# Altium schematic sheet Interfaz de Memoria.SchDoc
size Letter; ApprovedBy: M. en C. Fernando Bolaños; CheckedBy: M. en C. José Alberto Balderas Castillo (CID); Author: M. en C. José Alberto Balderas Castillo (CID); Revision: v1; NombreTarjeta: TELCOMGPRS-v1; NumeroDeHoja: 3 de 7; NombreBloque: Memorias externas EEPROM; FechaDiseno: 02-Junio-2015; FechaRevision: 05-Junio-2015; FechaAprobacion: 16-Junio-2015; TamanoHoja: Carta; NombreProyecto: Telemetria GPRS de Bajo Consumo de Energia
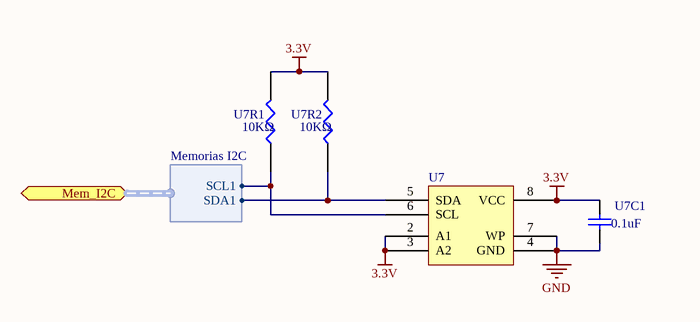
[diagram p0: Interfaz de Memoria.SchDoc]

## Parts
U7  CAT24M01WI-GT3  [SO-G8/Y1.9]  (value not drawn)
U7C1  0.1uF  [0603 - CAP]
U7R1  10KΩ  [0805-RES]
U7R2  10KΩ  [0805-RES]

## Ports
Mem_I2C (harness Memorias I2C)

## Harnesses
Memorias I2C: SDA1, SCL1

## Nets
3.3V: U7.2(A1) U7.3(A2) U7.8(VCC) U7C1.2 U7R1.2 U7R2.2
GND: U7.4(GND) U7.7(WP) U7C1.1
NetU7_5: U7.5(SDA) U7R2.1 ; port Mem_I2C.SDA1
NetU7_6: U7.6(SCL) U7R1.1 ; port Mem_I2C.SCL1

Not connected (* = marked no-connect by the designer): U7 1(NC)

## Notes on the sheet
- Elaboró
- Fecha
- Nombre del artículo
- Revisó
- Aprobó
- Número de parte
- Revisión
- Escala
- N/A
- Sección afectada
- Descripción del cambio
- Lámina
- 1/1
- Tolerancias
- Ruta del archivo

## Library data of the parts
U7 = AT24C1024BN-SH-B: IC EEPROM 1MBIT 1MHZ 8SOIC I2C; Manufacturer: ON Semiconductor; Supplier 1: Digi-Key; Supplier Part Number 1: CAT24M01WI-GT3OSCT-ND; Manufacturer Part Number: CAT24M01WI-GT3
U7C1 = Cap: CAP CERAMIC 0.1UF, 25V, X7R, 0603; Manufacturer Part Number: CGJ3E2X7R1E104K080AA; Manufacturer: TDK Corporation; Value: 0.1uF; Supplier 1: Digi-Key; Supplier Part Number 1: 445-8129-1-ND
U7R1 U7R2 = RES1: 10 kOhms ±5% 0.125W, 1/8W Chip Resistor 0805; Manufacturer Part Number: RC0805JR-0710KL; Manufacturer: Yageo; Value: 10KΩ; Supplier 1: Digi-Key; Supplier Part Number 1: 311-10KARCT-ND